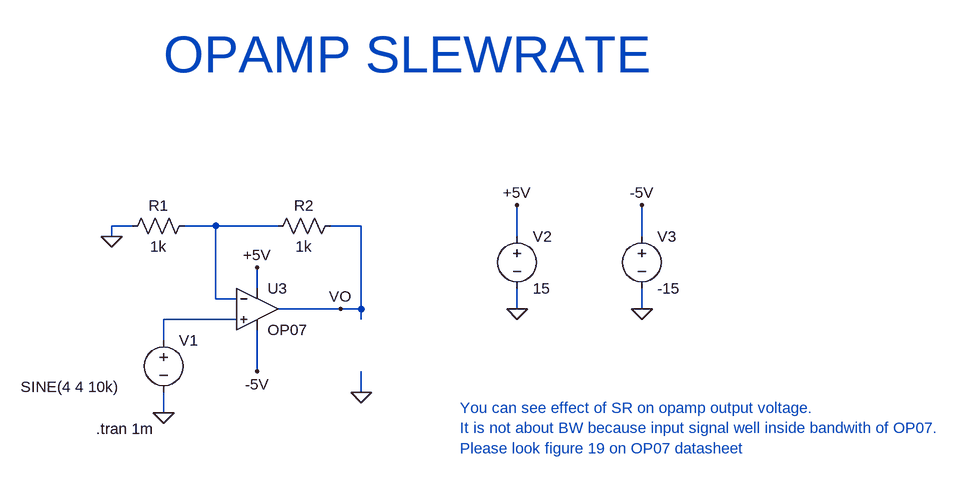
[diagram p0: schematic SR.asc]
SR.asc, the LTspice schematic file:
Version 4
SHEET 1 2804 680
WIRE -48 48 -80 48
WIRE 80 48 32 48
WIRE 176 48 80 48
WIRE 304 48 256 48
WIRE -80 64 -80 48
WIRE 544 64 544 16
WIRE 736 64 736 16
WIRE 144 144 144 112
WIRE 80 160 80 48
WIRE 112 160 80 160
WIRE 272 176 176 176
WIRE 304 176 304 48
WIRE 304 176 272 176
WIRE 544 176 544 144
WIRE 736 176 736 144
WIRE 112 192 0 192
WIRE 304 192 304 176
WIRE 0 224 0 192
WIRE 144 272 144 208
WIRE 304 304 304 272
WIRE 0 336 0 304
FLAG 0 336 0
FLAG -80 64 0
FLAG 544 16 +5V
FLAG 544 176 0
FLAG 144 112 +5V
FLAG 272 176 VO
FLAG 736 16 -5V
FLAG 736 176 0
FLAG 144 272 -5V
FLAG 304 304 0
SYMBOL res 48 32 R90
WINDOW 0 0 56 VBottom 2
WINDOW 3 32 56 VTop 2
SYMATTR InstName R1
SYMATTR Value 1k
SYMBOL res 272 32 R90
WINDOW 0 0 56 VBottom 2
WINDOW 3 32 56 VTop 2
SYMATTR InstName R2
SYMATTR Value 1k
SYMBOL voltage 544 48 R0
WINDOW 123 0 0 Left 0
WINDOW 39 0 0 Left 0
SYMATTR InstName V2
SYMATTR Value 15
SYMBOL voltage 736 48 R0
WINDOW 123 0 0 Left 0
WINDOW 39 0 0 Left 0
SYMATTR InstName V3
SYMATTR Value -15
SYMBOL voltage 0 208 R0
WINDOW 3 -220 88 Left 2
WINDOW 123 0 0 Left 0
WINDOW 39 24 124 Left 2
SYMATTR InstName V1
SYMATTR Value SINE(4 4 10k)
SYMBOL Opamps\\OP07 144 112 R0
SYMATTR InstName U3
TEXT -104 360 Left 2 !.tran 1m
TEXT 0 -216 Left 6 ;OPAMP SLEWRATE
TEXT 456 328 Left 2 ;You can see effect of SR on opamp output voltage.\nIt is not about BW because input signal well inside bandwith of OP07.\nPlease look figure 19 on OP07 datasheet

The netlist it stands for:
* SR.asc
R1 N001 0 1k
R2 VO N001 1k
V2 +5V 0 15
V3 -5V 0 -15
V1 N002 0 SINE(4 4 10k)
XU3 N002 N001 +5V -5V VO LT1001  ; OP07, pins In+ In- V+ V- OUT
.tran 1m
* OPAMP SLEWRATE
* You can see effect of SR on opamp output voltage.
* It is not about BW because input signal well inside bandwith of OP07.
* Please look figure 19 on OP07 datasheet
.lib LTC.lib
.backanno
.end